# Altium schematic sheet SC942C_Variateurs.SchDoc: Variateurs
size 393 x 270 mm; CompanyName: Seccom; Address1: 521, rue du capt. François Garbit; Address2: 69440 Mornant; Address3: seccom@seccom.fr; Address4: www.seccom.fr; DocumentNumber: 6; SheetNumber: 6; SheetTotal: 8; PageSetup: Record=PageOptions|CenterHorizontal=True|CenterVertical=True|PrintScale=0.74|XCorrection=1.00|YCorrection=1.00|PrintKind=0|BorderSize=5000000|LeftOffset=0|BottomOffset=0|Orientation=2|PaperLength=1000|PaperWidth=1000|Scale=100|PaperSource=7|PrintQuality=-4|MediaType=1|DitherType=10|PaperKind=A4|PrintScaleMode=1
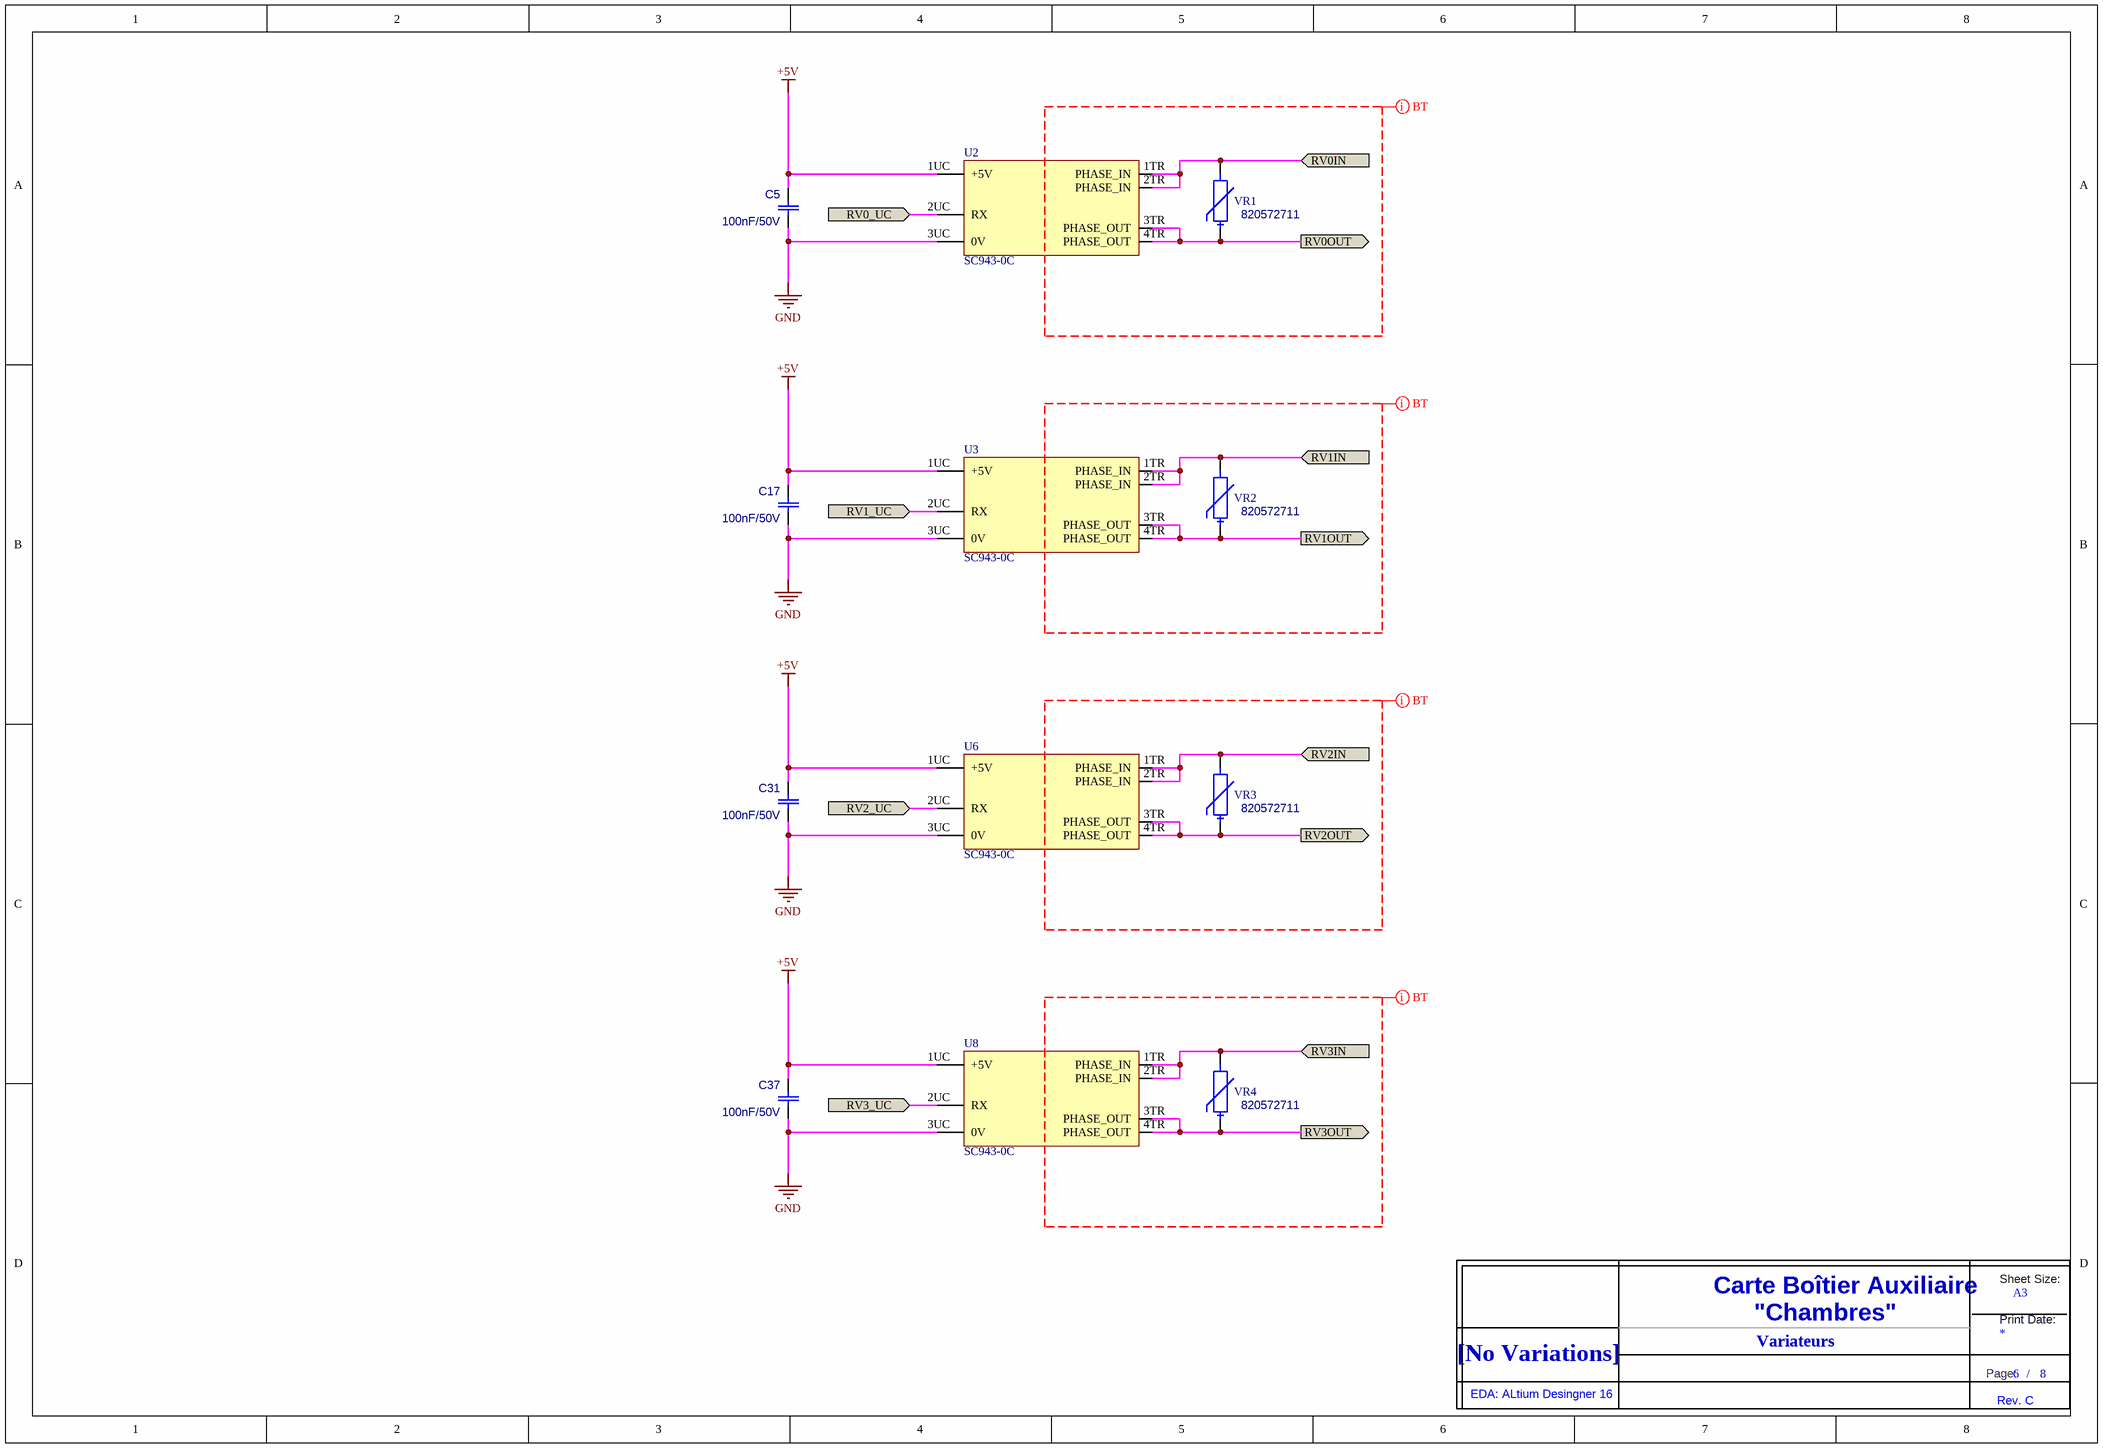
[diagram p0: SC942C_Variateurs.SchDoc]

## Parts
C5  value 100nF/50V  [0805_ReflowSoldering_CAP]  (hidden comment: C_0805_X7R_10%_100N-50V)
C17  value 100nF/50V  [0805_ReflowSoldering_CAP]  (hidden comment: C_0805_X7R_10%_100N-50V)
C31  value 100nF/50V  [0805_ReflowSoldering_CAP]  (hidden comment: C_0805_X7R_10%_100N-50V)
C37  value 100nF/50V  [0805_ReflowSoldering_CAP]  (hidden comment: C_0805_X7R_10%_100N-50V)
Title_new?  DNI  (value not drawn)  (graphical)
U2  SC943-0C  [SI943C_REV_A]
U3  SC943-0C  [SI943C_REV_A]
U6  SC943-0C  [SI943C_REV_A]
U8  SC943-0C  [SI943C_REV_A]
VR1  value 820572711  [VDR_Serie_820_d7_h13_e5mm]  (hidden comment: VDR_820572711)
VR2  value 820572711  [VDR_Serie_820_d7_h13_e5mm]  (hidden comment: VDR_820572711)
VR3  value 820572711  [VDR_Serie_820_d7_h13_e5mm]  (hidden comment: VDR_820572711)
VR4  value 820572711  [VDR_Serie_820_d7_h13_e5mm]  (hidden comment: VDR_820572711)

## Ports
RV0_UC (in), RV0IN (in), RV0OUT (out), RV1_UC (in), RV1IN (in), RV1OUT (out), RV2_UC (in), RV2IN (in), RV2OUT (out), RV3_UC (in), RV3IN (in), RV3OUT (out)

## Nets
+5V: C5.1 C17.1 C31.1 C37.1 U2.1UC(+5V) U3.1UC(+5V) U6.1UC(+5V) U8.1UC(+5V)
GND: C5.2 C17.2 C31.2 C37.2 U2.3UC(0V) U3.3UC(0V) U6.3UC(0V) U8.3UC(0V)
RV0_UC: U2.2UC(RX) ; port RV0_UC
RV0IN: U2.1TR(PHASE_IN) U2.2TR(PHASE_IN) VR1.2 ; port RV0IN
RV0OUT: U2.3TR(PHASE_OUT) U2.4TR(PHASE_OUT) VR1.1 ; port RV0OUT
RV1_UC: U3.2UC(RX) ; port RV1_UC
RV1IN: U3.1TR(PHASE_IN) U3.2TR(PHASE_IN) VR2.2 ; port RV1IN
RV1OUT: U3.3TR(PHASE_OUT) U3.4TR(PHASE_OUT) VR2.1 ; port RV1OUT
RV2_UC: U6.2UC(RX) ; port RV2_UC
RV2IN: U6.1TR(PHASE_IN) U6.2TR(PHASE_IN) VR3.2 ; port RV2IN
RV2OUT: U6.3TR(PHASE_OUT) U6.4TR(PHASE_OUT) VR3.1 ; port RV2OUT
RV3_UC: U8.2UC(RX) ; port RV3_UC
RV3IN: U8.1TR(PHASE_IN) U8.2TR(PHASE_IN) VR4.2 ; port RV3IN
RV3OUT: U8.3TR(PHASE_OUT) U8.4TR(PHASE_OUT) VR4.1 ; port RV3OUT

## Layout directives
net class BT: (no net found under the mark)

## Notes on the sheet
- Variateurs
- (in symbol Title_new_1) Sheet Size:; Carte Boîtier Auxiliaire; A3; "Chambres"; Print Date:; [No Variations]; Page:; /; EDA: ALtium Desingner 16; Rev. C

## Library data of the parts
C5 C17 C31 C37 = C_0805_X7R_10%_100N-50V: Condensateur céramique, X7R, 10%, CMS 0805; Creation: LJ; Verification: LJ (28/05/04); Reference: 000042/00; Boitier: 0805; Remarque: {Remarque}; Fabricant: AVX; Ref Fab: 08055C104KAT2A; Coeff: 1; ComponentLink1URL: o:\_Documentation\Datasheets\BC_Components\Condo_CMS_NPO-X7R-Y5V.pdf; ComponentLink2URL: o:\_Documentation\Datasheets\_BOITIERS\PASSIF_CMS\RC_0805_(2x1,25)_(Schneider).PDF; Config: *; ComponentLink1Description: Datasheet; ComponentLink2Description: Datasheet Boitier; Supplier 1: Farnell; Supplier Part Number 1: 499687
Title_new? = Title_new_1
U2 U3 U6 U8 = SC943-0C: Carte gradateur; Boitier: SI943C; Coeff: 1; Fabricant: Valentinéa; Remarque: {Remarque}; Ref Fab: SC943-0C; Value: SC943-0C
VR1-VR4 = VDR_820572711: Varistance disque 275Vac, 350Vdc, 33J, Vbreak=430V@1mA, Vclamp=710V@10A, Ipeak=1200A; Creation: LJ (12/01/12); Reference: {Reference}; Boitier: d7_t4.6_h13_e5mm; Remarque: {Remarque}; Fabricant: Wurth Elektronik; Coeff: 1; Ref Fab: 820572711; ComponentLink1URL: o:\_Documentation\Datasheets\Wurth_Elektronik\Varistance_820572711.pdf; ComponentLink2URL: o:\_Documentation\Datasheets\; Config: *; ComponentLink1Description: Datasheet; ComponentLink2Description: Datasheet Boitier